# EAGLE schematic tvp3 (EAGLE 8.1.1)

## Sheet 1 of 2
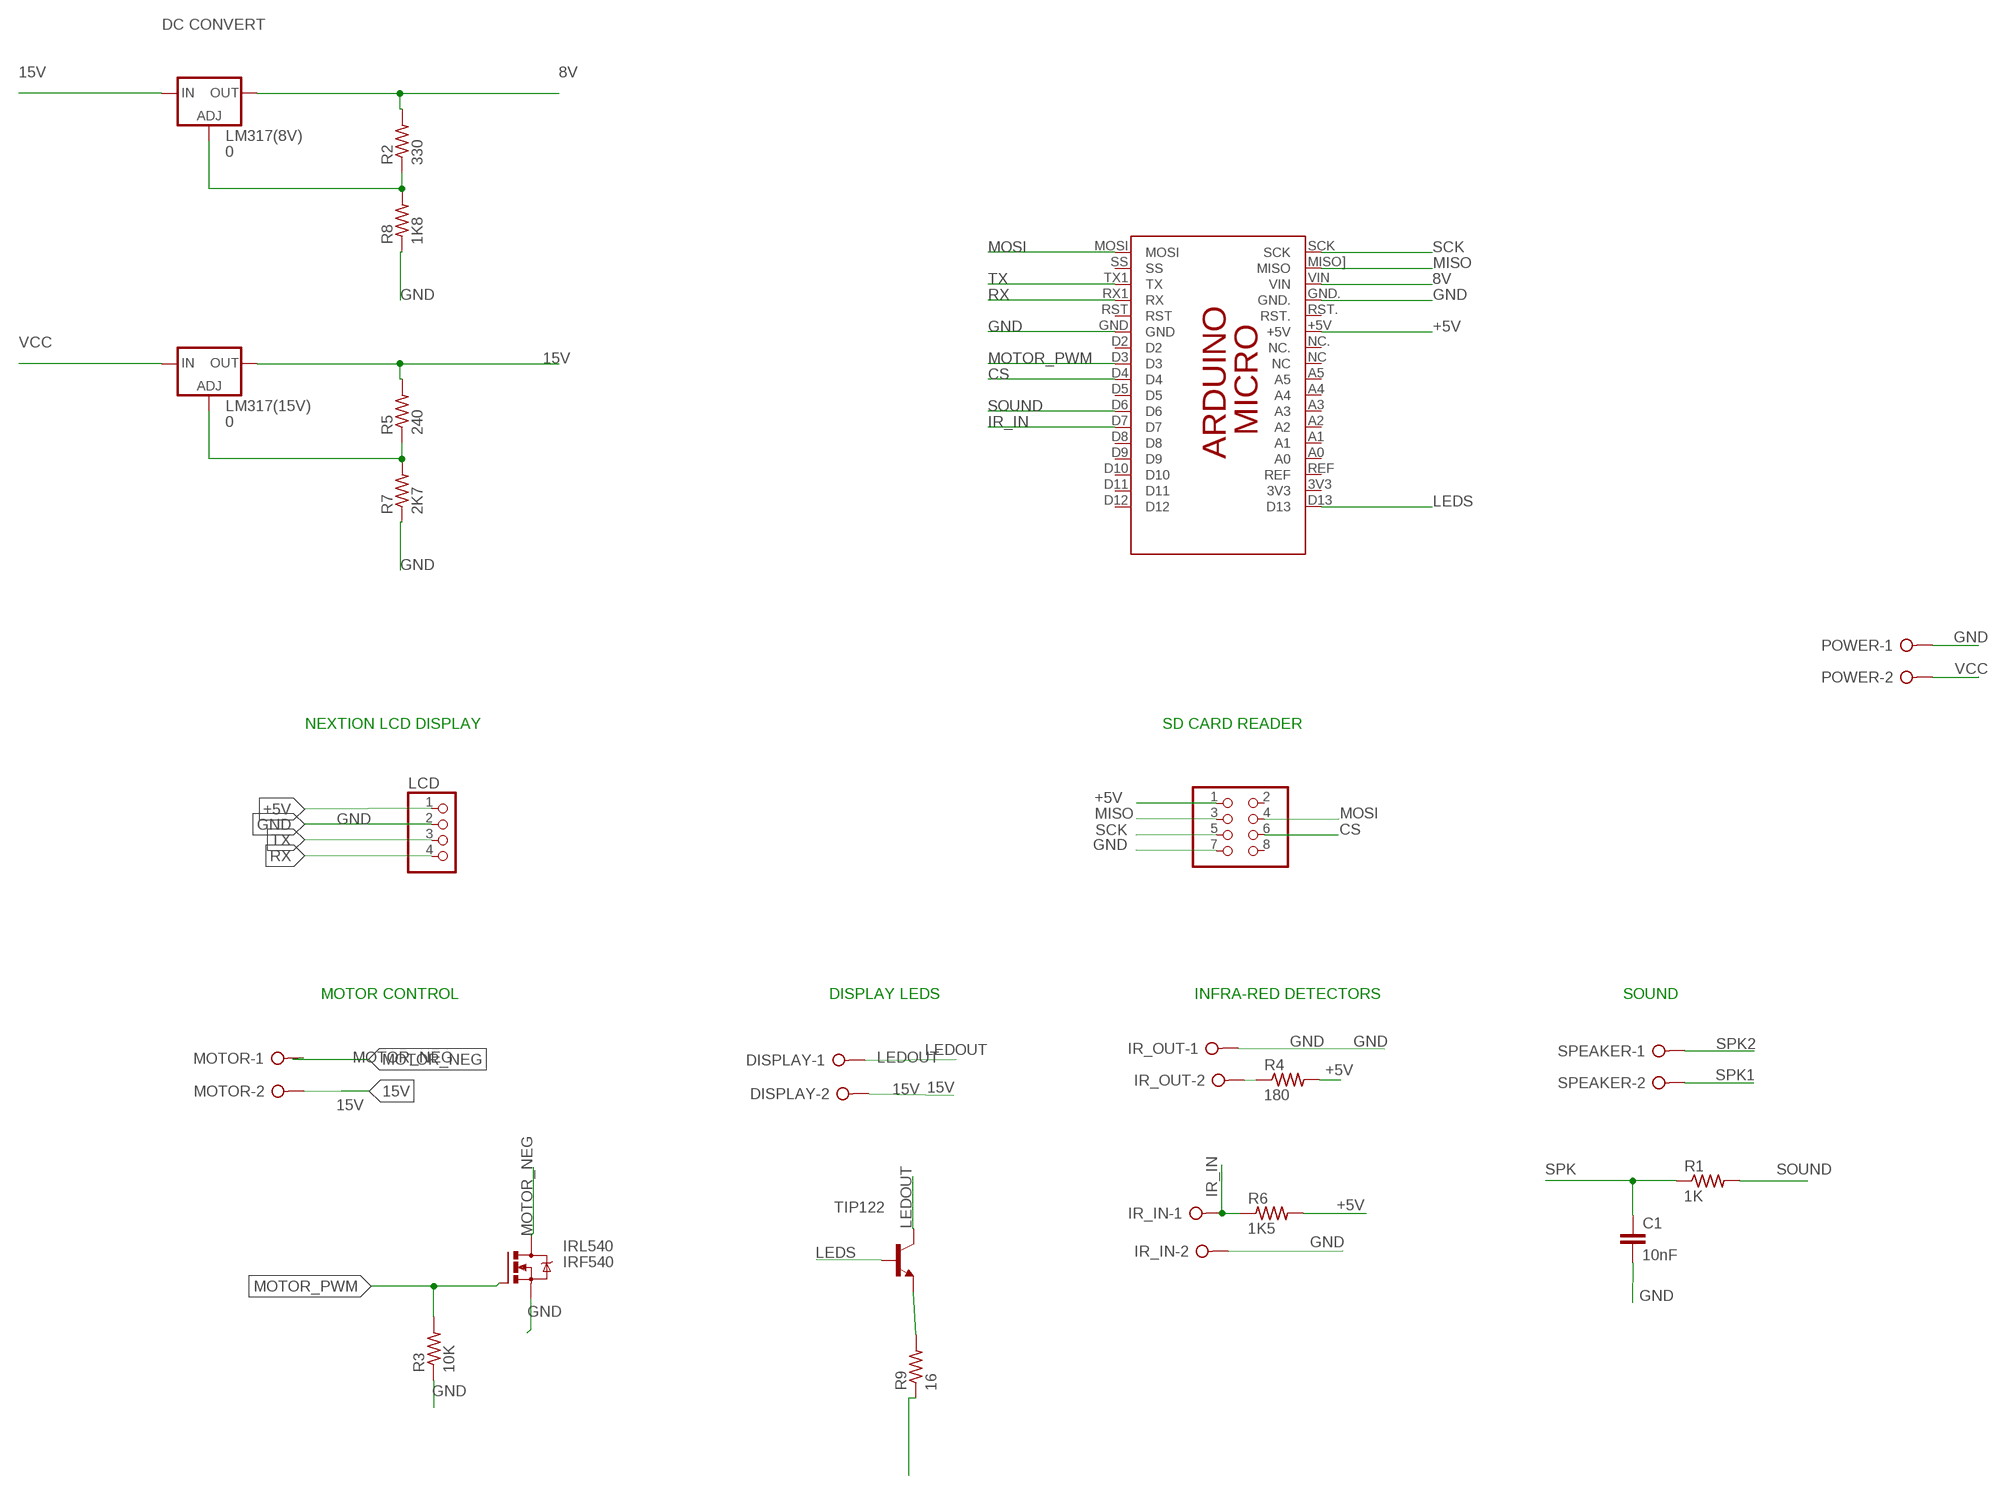
[diagram p0: schematic, sheet 1]

### Parts
_  PINHD-2X4  [2X04]
C1  10nF  C2.5/2  [C2.5-2]
DISPLAY  W237-02P  [W237-132]
IR_IN  W237-02P  [W237-132]
IR_OUT  W237-02P  [W237-132]
IRL540  IRF540  [TO220BV]
LCD  PINHD-1X4  [1X04]
LM317(8V)  0  LM317TS  [317TS]
LM317(15V)  0  LM317TS  [317TS]
MOTOR  W237-02P  [W237-132]
PCB2  ARDUINO_MICRO  [ARDUINO_MICRO]
POWER  W237-02P  [W237-132]
R1  1K  R-US_0207/10  [0207/10]
R2  330  R-US_0207/10  [0207/10]
R3  10K  R-US_0207/10  [0207/10]
R4  180  R-US_0207/10  [0207/10]
R5  240  R-US_0207/10  [0207/10]
R6  1K5  R-US_0207/10  [0207/10]
R7  2K7  R-US_0207/10  [0207/10]
R8  1K8  R-US_0207/10  [0207/10]
R9  16  R-US_0207/10  [0207/10]
SPEAKER  W237-02P  [W237-132]
TIP122  -NPN-TO220V  [TO220V]

### Nets
8V: LM317(8V).2(OUT) PCB2.VIN R2.2
15V: DISPLAY.2 LM317(8V).3(IN) LM317(15V).2(OUT) MOTOR.2 R5.2
+5V: _.1 LCD.1 PCB2.+5V R4.2 R6.2 ; also sheet 2
CS: _.6 PCB2.D4
GND: _.7 C1.2 IR_IN.2 IR_OUT.1 IRL540.S LCD.2 PCB2.GND PCB2.GND. POWER.1 R3.1 R7.1 R8.1 R9.1 ; also sheet 2
IR_IN: IR_IN.1 PCB2.D7 R6.1
IR_OUT: IR_OUT.2 R4.1
LEDOUT: DISPLAY.1 TIP122.2(C)
LEDS: PCB2.D13 TIP122.1(B)
MISO: _.3 PCB2.MISO](MISO)
MOSI: _.4 PCB2.MOSI
MOTOR_NEG: IRL540.D MOTOR.1
MOTOR_PWM: IRL540.G PCB2.D3 R3.2
N$1: LM317(15V).1(ADJ) R5.1 R7.2
N$2: R9.2 TIP122.3(E)
N$4: LM317(8V).1(ADJ) R2.1 R8.2
RX: LCD.4 PCB2.RX1(RX)
SCK: _.5 PCB2.SCK
SOUND: PCB2.D6 R1.2
SPK: C1.1 R1.1 ; also sheet 2
SPK1: SPEAKER.2 ; also sheet 2
SPK2: SPEAKER.1 ; also sheet 2
TX: LCD.3 PCB2.TX1(TX)
VCC: LM317(15V).3(IN) POWER.2
Unconnected: _.2 _.8 PCB2.3V3 PCB2.A0 PCB2.A1 PCB2.A2 PCB2.A3 PCB2.A4 PCB2.A5 PCB2.D2 PCB2.D5 PCB2.D8 PCB2.D9 PCB2.D10 PCB2.D11 PCB2.D12 PCB2.NC PCB2.NC. PCB2.REF PCB2.RST PCB2.RST. PCB2.SS

### Notes on the sheet
- DC CONVERT
- NEXTION LCD DISPLAY | SD CARD READER
- MOTOR CONTROL | DISPLAY LEDS | INFRA-RED DETECTORS | SOUND

## Sheet 2 of 2
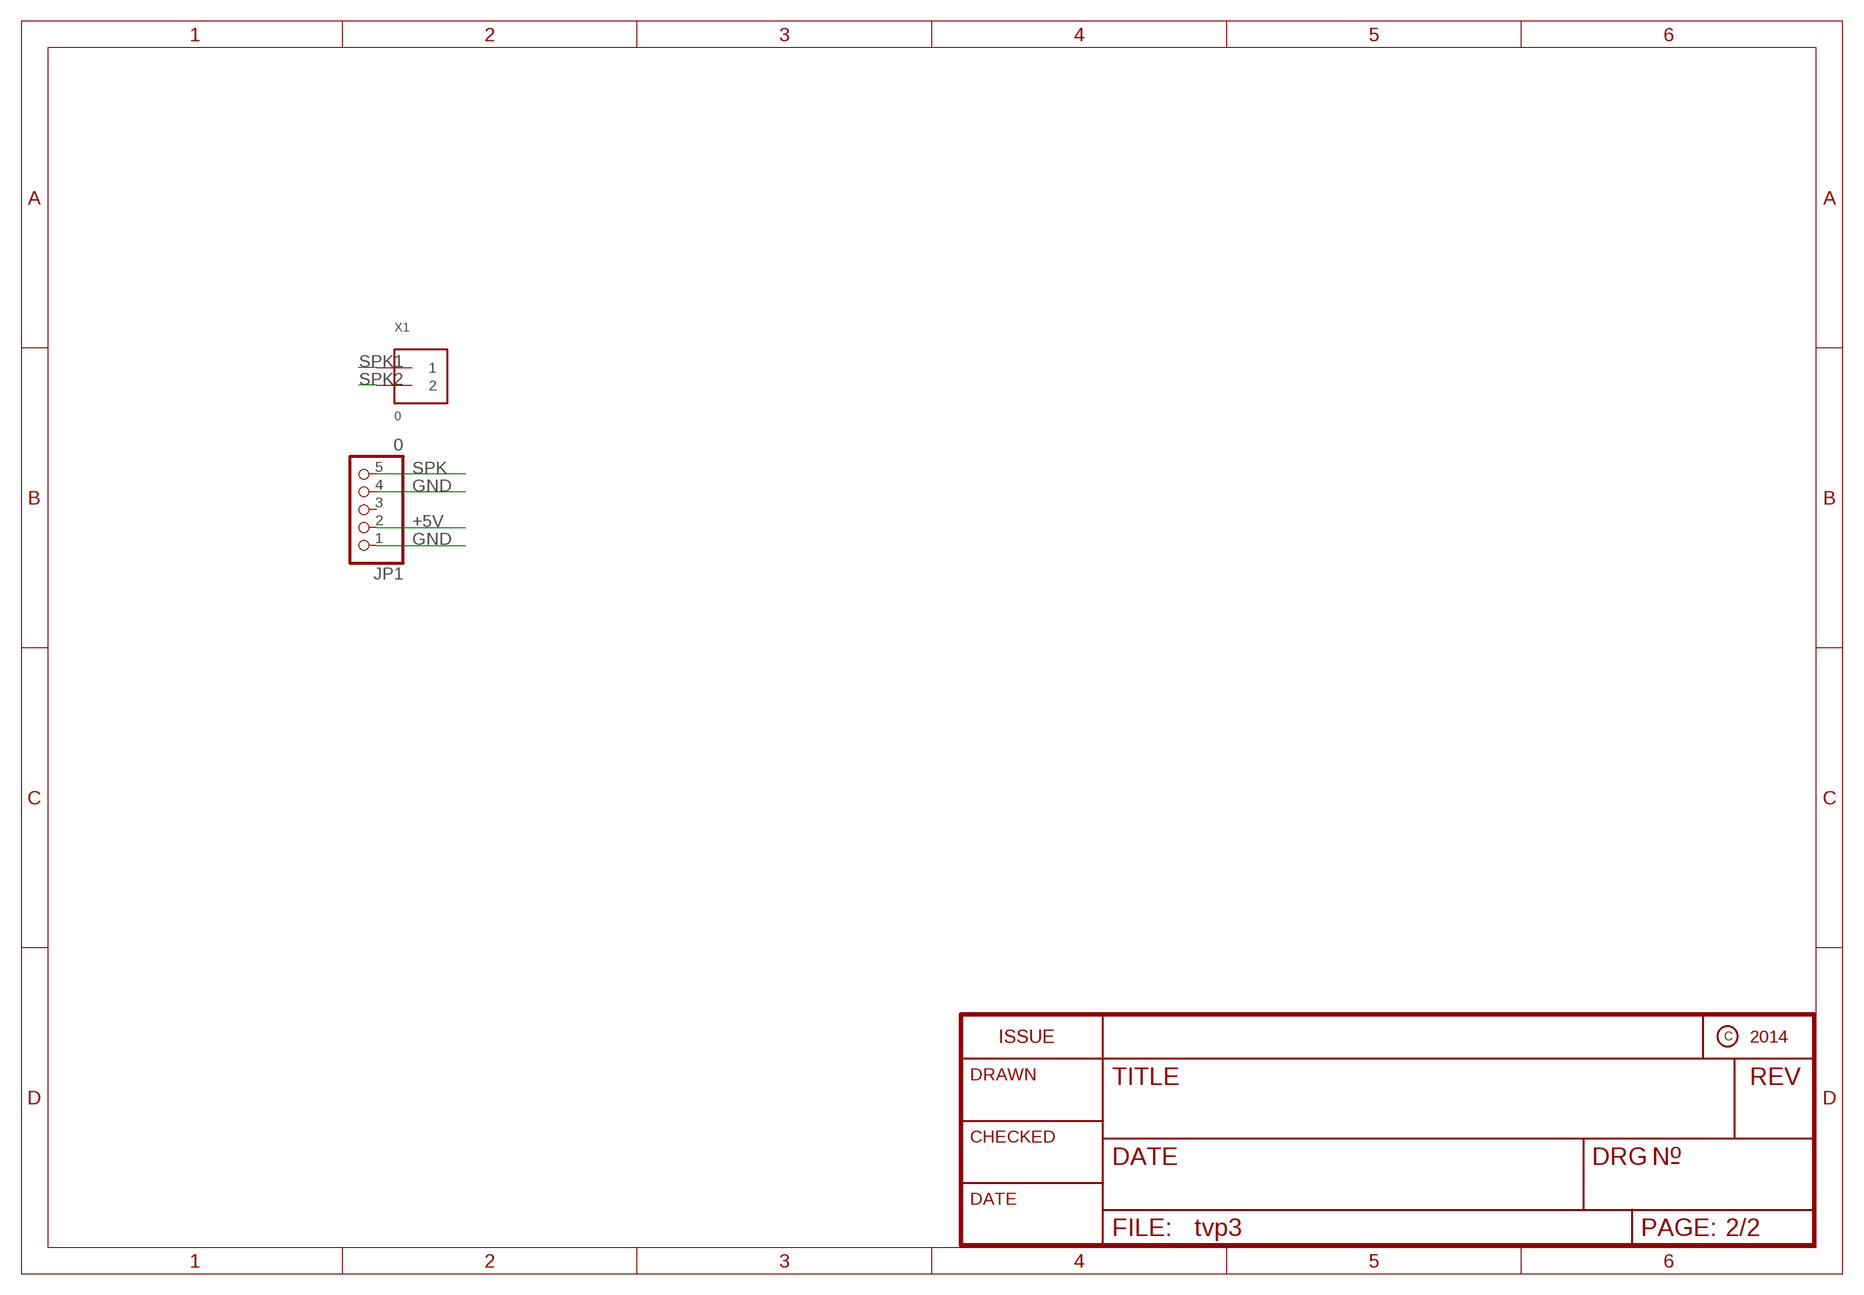
[diagram p1: schematic, sheet 2]

### Parts
JP1  0  HEADER-1X570MIL  [1X05_ROUND_70]
X1  0  TERMBLOCK_1X2  [TERMBLOCK_1X2-3.5MM]

### Nets
+5V: JP1.2 ; also sheet 1
GND: JP1.1 JP1.4 ; also sheet 1
SPK: JP1.5 ; also sheet 1
SPK1: X1.1 ; also sheet 1
SPK2: X1.2 ; also sheet 1
Unconnected: JP1.3

## Library data of the parts
_ = pinhead:PINHD-2X4: PIN HEADER
C1 = capacitor-wima:C: CAPACITOR naming: grid - package width
DISPLAY IR_IN IR_OUT MOTOR POWER SPEAKER = con-wago-508:W237-02P: WAGO SREW CLAMP; OC_FARNELL: unknown; OC_NEWARK: unknown
IRL540 = transistor-power:IRF540: HEXFET Power MOSFET
JP1 = microbuilder:HEADER-1X5: PIN HEADER
LCD = pinhead:PINHD-1X4: PIN HEADER
LM317(8V) LM317(15V) = v-reg:LM317TS: VOLTAGE REGULATOR
PCB2 = E14_Arduino_revC 2 boo:ARDUINO_MICRO: Device for representing an Arduino Micro board with a footprint in an EAGLE design. Created by Dave Young for Element14. More EAGLE documentation at: http://www.element14.com/community/community/knode/cadsoft_eagle
R1-R9 = rcl:R-US_: RESISTOR, American symbol
TIP122 = transistor-neu-to92:*-NPN-: NPN Transistror
X1 = microbuilder:TERMBLOCK_1X2: 3.5mm Terminal block http://www.ladyada.net/library/pcb/eaglelibrary.html